# EAGLE schematic LRA_TestSiteJunctionBox (EAGLE 8.7.1)
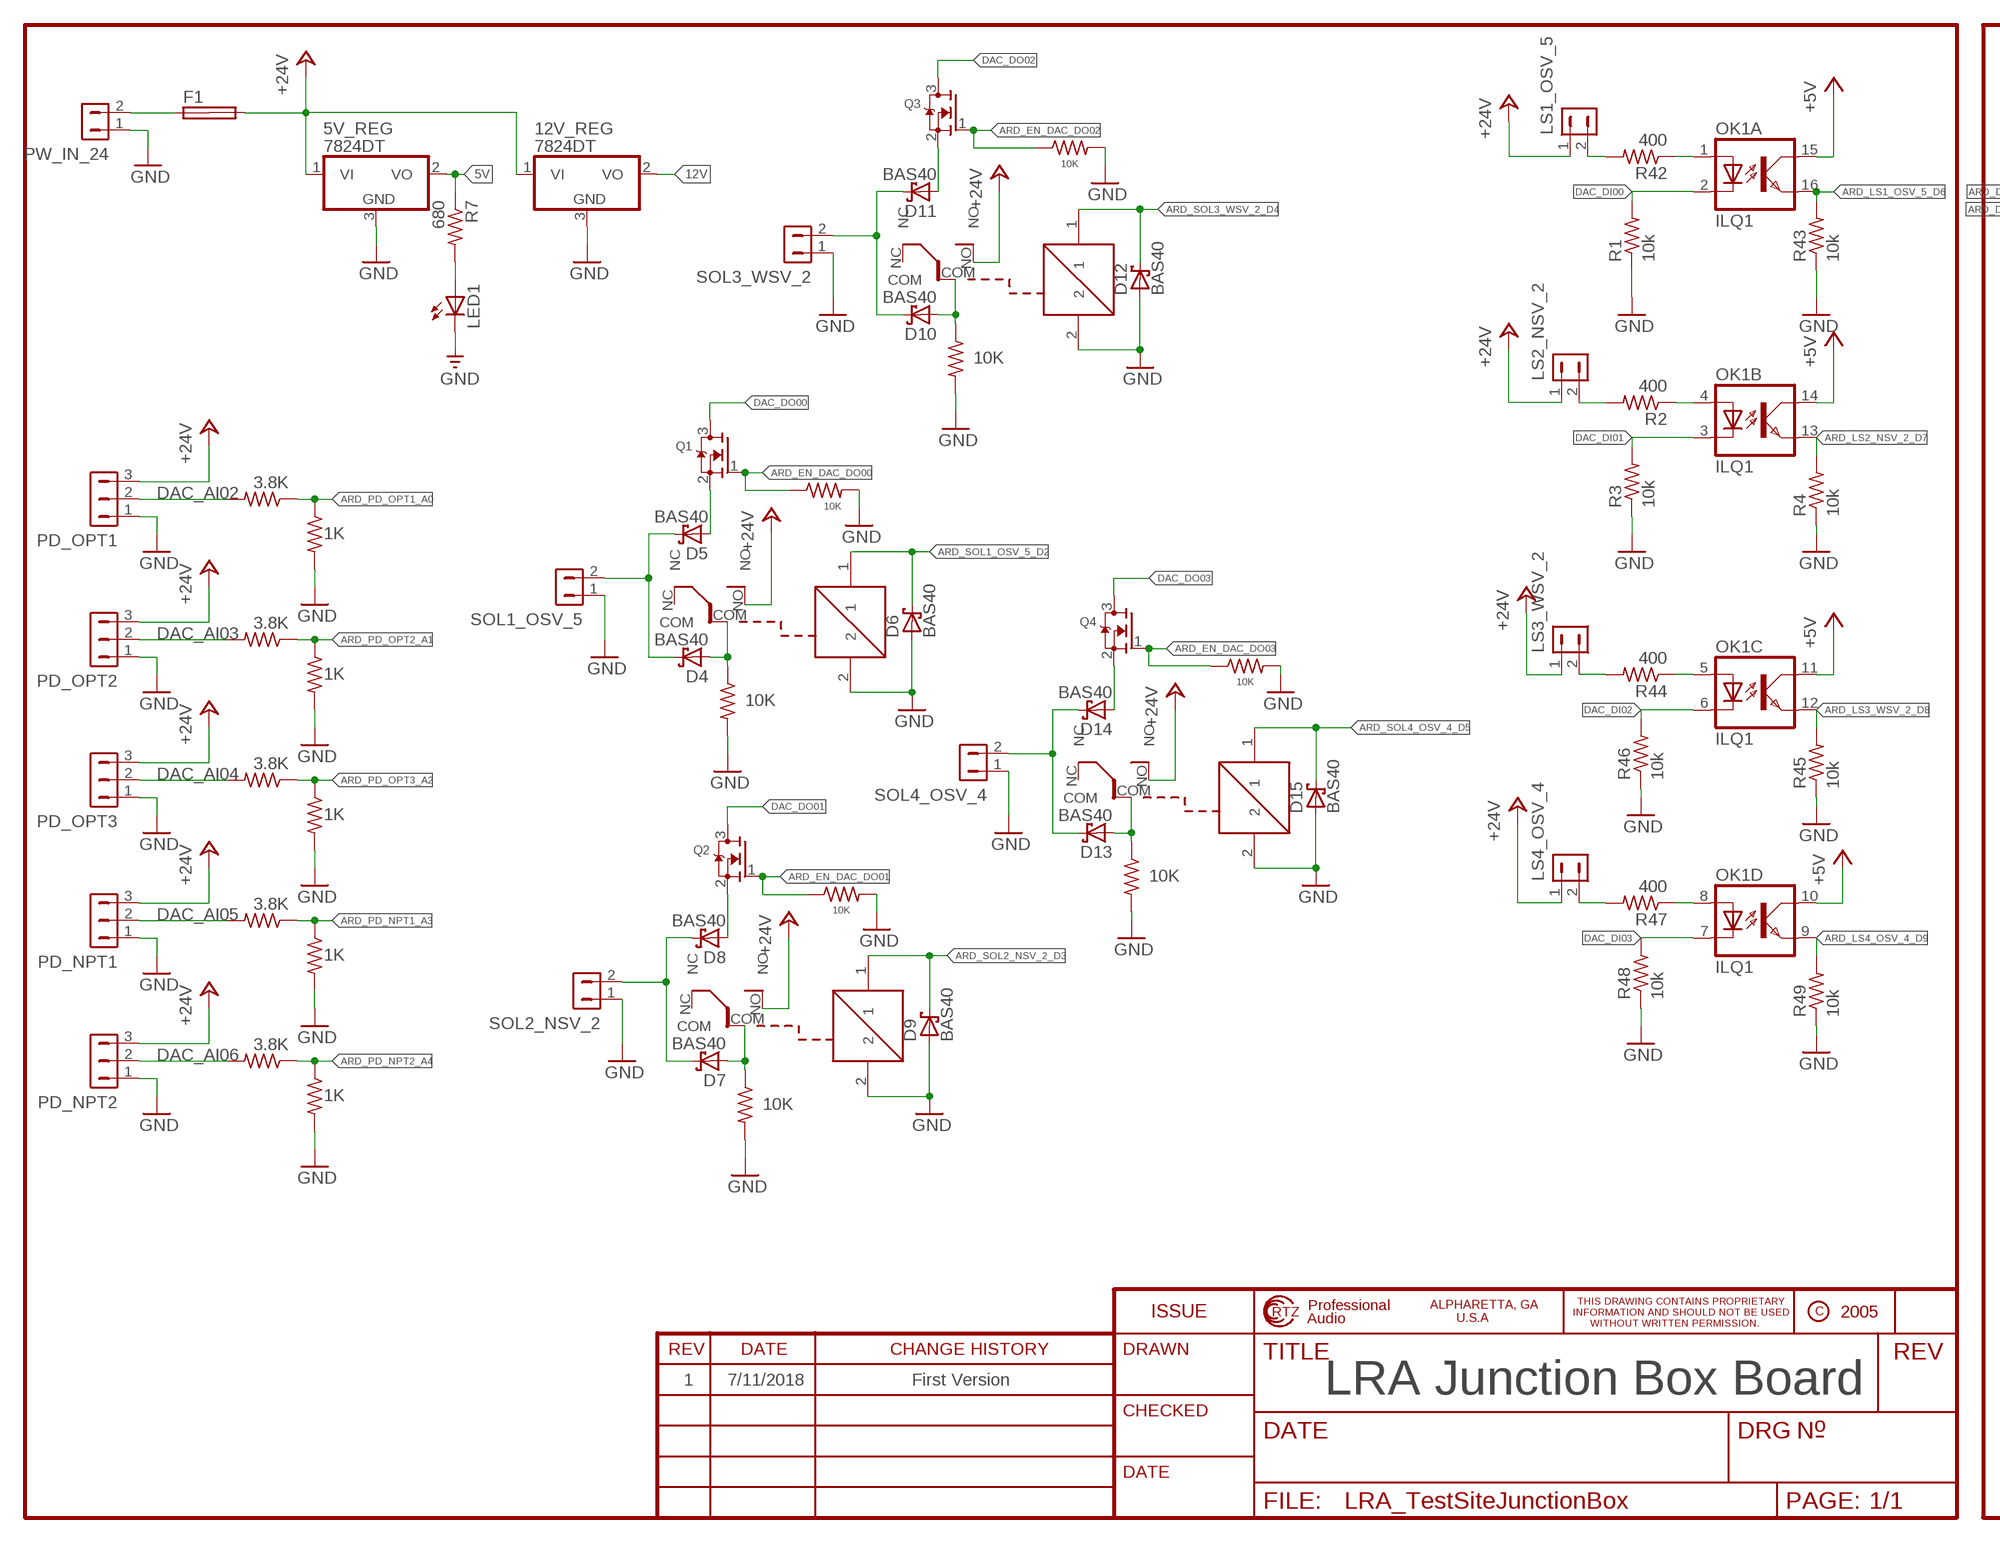
[diagram p0: schematic, sheet 1, part 1 of 2]
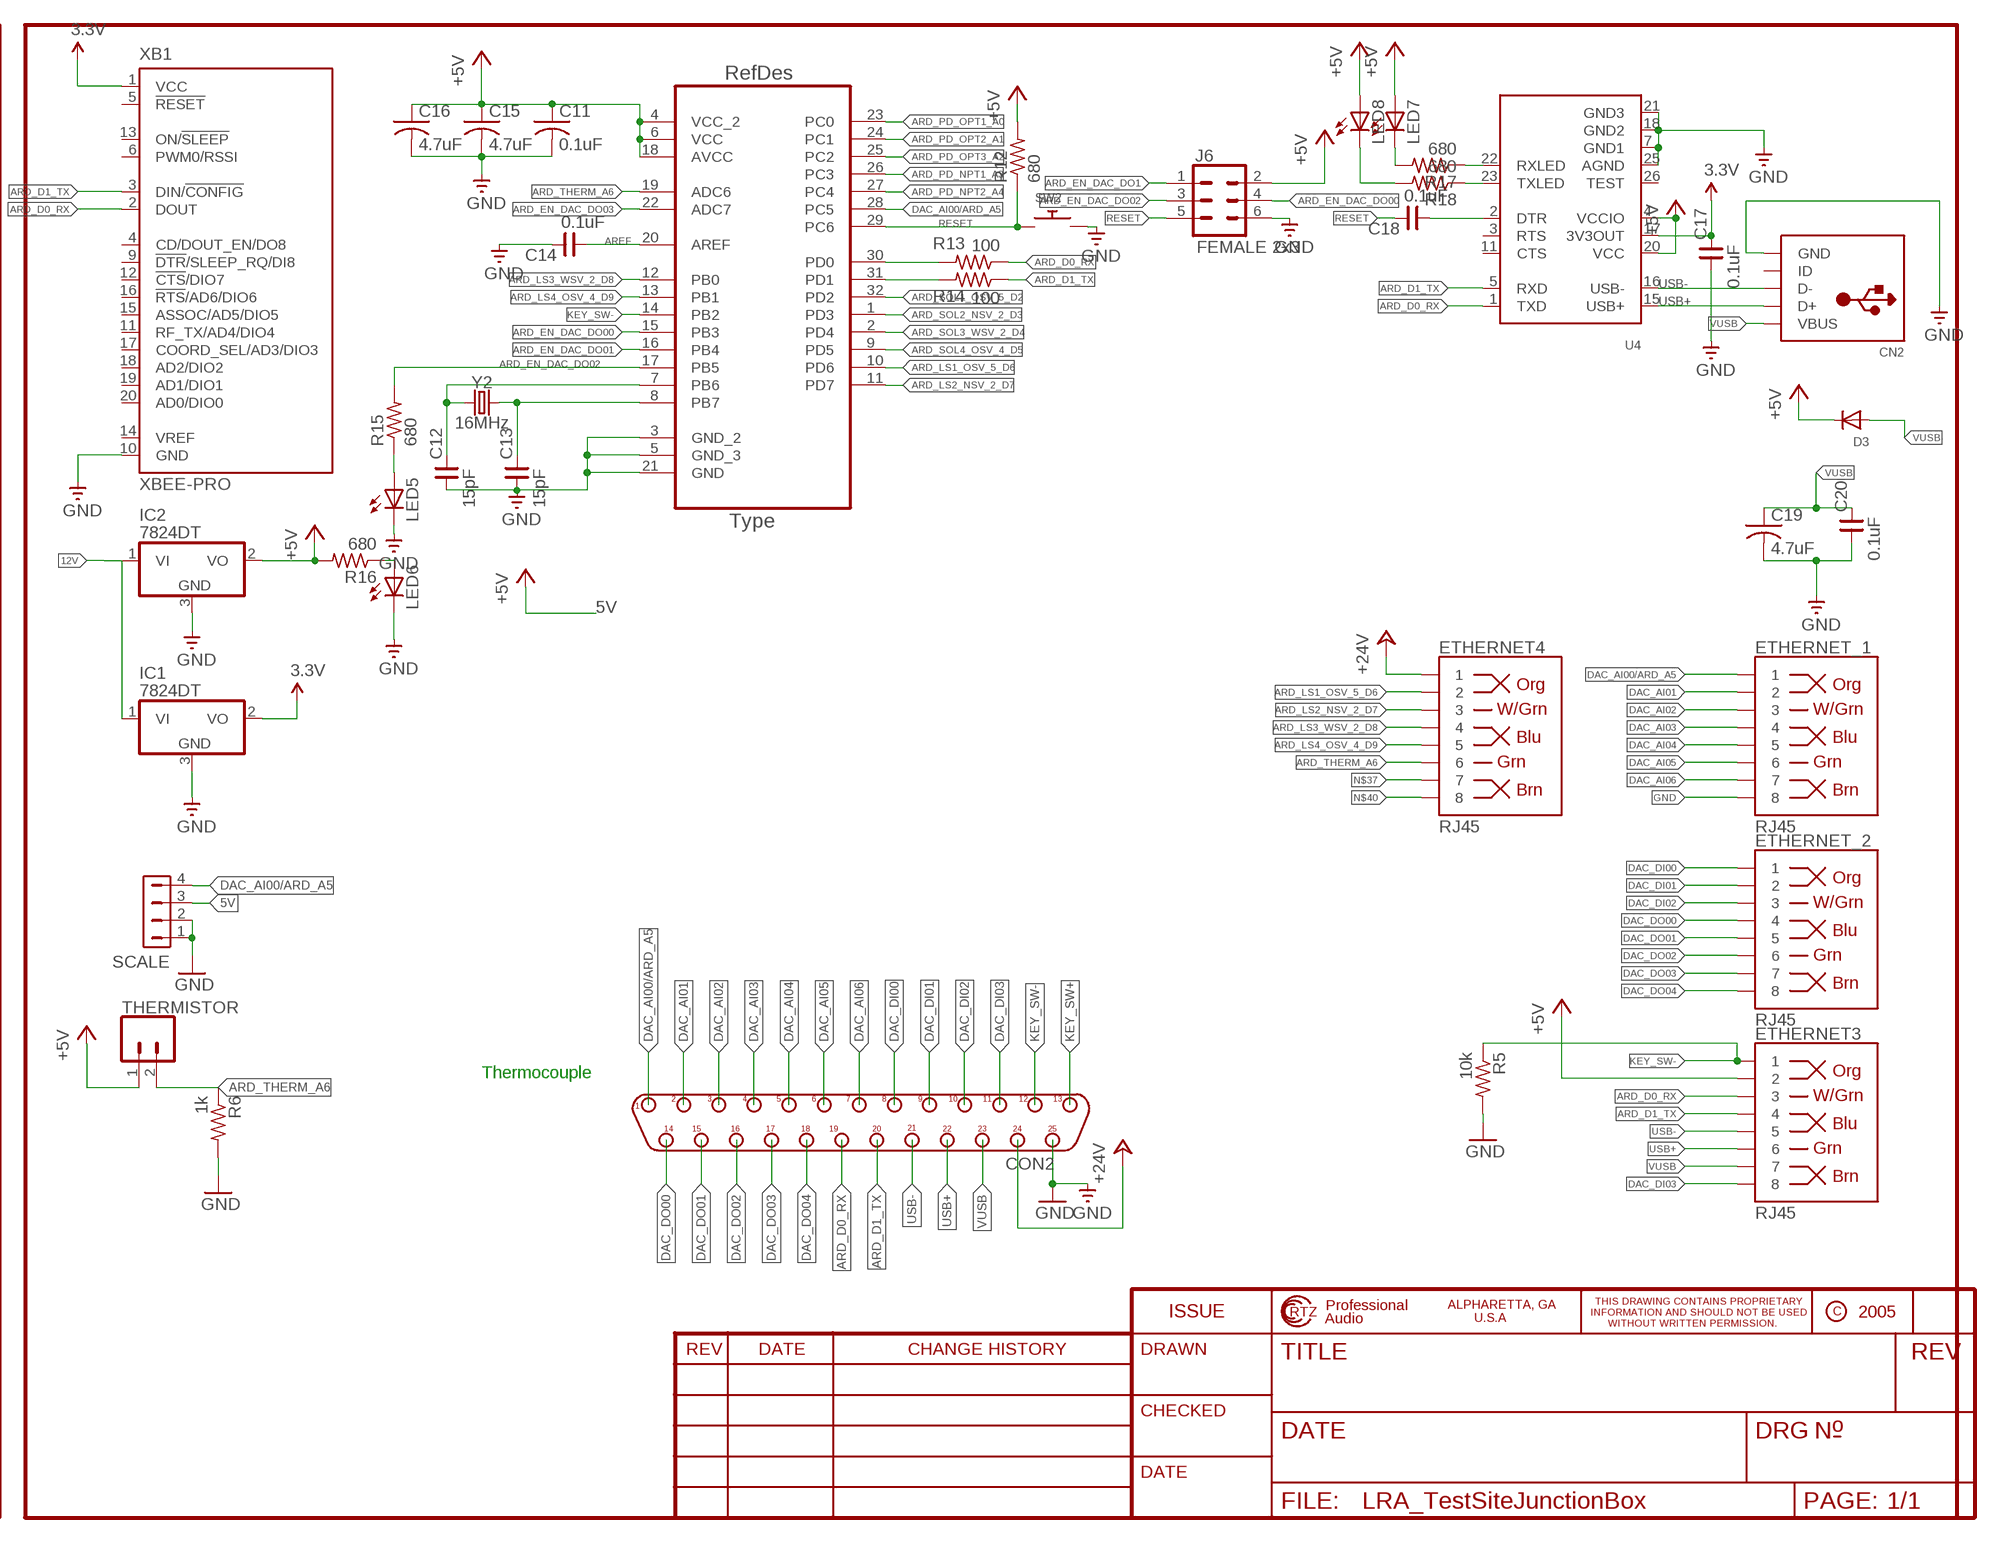
[diagram p1: schematic, sheet 1, part 2 of 2]

## Parts
5V_REG  7824DT  [TO252]
12V_REG  7824DT  [TO252]
C11  0.1uF  C-USC0805  [C0805]
C12  15pF  CNP-0805  [0805]
C13  15pF  CNP-0805  [0805]
C14  0.1uF  CNP-0805  [0805]
C15  4.7uF  C-USC0805  [C0805]
C16  4.7uF  C-USC0805  [C0805]
C17  0.1uF  CNP-0805  [0805]
C18  0.1uF  CNP-0805  [0805]
C19  4.7uF  C-USC0805  [C0805]
C20  0.1uF  CNP-0805  [0805]
CN2  USBMINIB  [USB-MINIB]
CON2  DB25M/90  [D-25M/90]
D3  DIODESOD-123  [SOD-123]
D4  BAS40  [SOT23]
D5  BAS40  [SOT23]
D6  BAS40  [SOT23]
D7  BAS40  [SOT23]
D8  BAS40  [SOT23]
D9  BAS40  [SOT23]
D10  BAS40  [SOT23]
D11  BAS40  [SOT23]
D12  BAS40  [SOT23]
D13  BAS40  [SOT23]
D14  BAS40  [SOT23]
D15  BAS40  [SOT23]
ETHERNET3  RJ45  RJ45-8  [RJ45-8]
ETHERNET4  RJ45  RJ45-8  [RJ45-8]
ETHERNET_1  RJ45  RJ45-8  [RJ45-8]
ETHERNET_2  RJ45  RJ45-8  [RJ45-8]
F1  SHK20L  [SHK20L]
IC1  7824DT  [TO252]
IC2  7824DT  [TO252]
J6  FEMALE 2x3  CONN_03X2FEMALE  [2X3]
LED1  LEDCHIPLED_0805  [CHIPLED_0805]
LED5  LEDCHIPLED_0805  [CHIPLED_0805]
LED6  LEDCHIPLED_0805  [CHIPLED_0805]
LED7  LEDCHIPLED_0805  [CHIPLED_0805]
LED8  LEDCHIPLED_0805  [CHIPLED_0805]
LS1_OSV_5  HDR-1X2-MTA-100  [MTA-100-2V]
LS2_NSV_2  HDR-1X2-MTA-100  [MTA-100-2V]
LS3_WSV_2  HDR-1X2-MTA-100  [MTA-100-2V]
LS4_OSV_4  HDR-1X2-MTA-100  [MTA-100-2V]
OK1  ILQ1  [DIL16]
PD_NPT1  HDR-1X3-MTA-100  [MTA-100-3V]
PD_NPT2  HDR-1X3-MTA-100  [MTA-100-3V]
PD_OPT1  HDR-1X3-MTA-100  [MTA-100-3V]
PD_OPT2  HDR-1X3-MTA-100  [MTA-100-3V]
PD_OPT3  HDR-1X3-MTA-100  [MTA-100-3V]
PW_IN_24  HDR-1X2-MTA-100  [MTA-100-2V]
Q1  MOSFET-NREFLOW  [SOT23]
Q2  MOSFET-NREFLOW  [SOT23]
Q3  MOSFET-NREFLOW  [SOT23]
Q4  MOSFET-NREFLOW  [SOT23]
R1  10k  R-US_M0805  [M0805]
R2  400  R-US_M0805  [M0805]
R3  10k  R-US_M0805  [M0805]
R4  10k  R-US_M0805  [M0805]
R5  10k  R-US_R0805  [R0805]
R6  1k  R-US_R0805  [R0805]
R7  680  R-US_R0805  [R0805]
R12  680  R-US_R0805  [R0805]
R13  100  R-US_R0805  [R0805]
R14  100  R-US_R0805  [R0805]
R15  680  R-US_R0805  [R0805]
R16  680  R-US_R0805  [R0805]
R17  680  R-US_R0805  [R0805]
R18  680  R-US_R0805  [R0805]
R24  3.8K  R-US_M0805  [M0805]
R25  1K  R-US_M0805  [M0805]
R26  3.8K  R-US_M0805  [M0805]
R27  1K  R-US_M0805  [M0805]
R28  3.8K  R-US_M0805  [M0805]
R29  1K  R-US_M0805  [M0805]
R30  3.8K  R-US_M0805  [M0805]
R31  1K  R-US_M0805  [M0805]
R32  3.8K  R-US_M0805  [M0805]
R33  1K  R-US_M0805  [M0805]
R34  10K  R-US_M0805  [M0805]
R35  10K  R-US_M0805  [M0805]
R36  10K  R-US_M0805  [M0805]
R37  10K  R-US_M0805  [M0805]
R38  10K  R-US_M0805  [M0805]
R39  10K  R-US_M0805  [M0805]
R40  10K  R-US_M0805  [M0805]
R41  10K  R-US_M0805  [M0805]
R42  400  R-US_M0805  [M0805]
R43  10k  R-US_M0805  [M0805]
R44  400  R-US_M0805  [M0805]
R45  10k  R-US_M0805  [M0805]
R46  10k  R-US_M0805  [M0805]
R47  400  R-US_M0805  [M0805]
R48  10k  R-US_M0805  [M0805]
R49  10k  R-US_M0805  [M0805]
SCALE  HDR-1X4-MTA-100  [MTA-100-4V]
SOL1_OSV_5  HDR-1X2-MTA-100  [MTA-100-2V]
SOL2_NSV_2  HDR-1X2-MTA-100  [MTA-100-2V]
SOL3_WSV_2  HDR-1X2-MTA-100  [MTA-100-2V]
SOL4_OSV_4  HDR-1X2-MTA-100  [MTA-100-2V]
SW2  SWITCH_PUSHBUTTONEVQ-PE  [TACT_PANA-EVQ]
THERMISTOR  CONN_025MM  [SCREWTERMINAL-5MM-2]
U3  ATMEGA328P-AU  [QFP80P900X900X120-32N]
U4  FT232RLSSOP28  [SSOP28DB]
U$2  RW-SH  [RW-SH]
U$3  RW-SH  [RW-SH]
U$4  RW-SH  [RW-SH]
U$5  RW-SH  [RW-SH]
XB1  XBEE-PRO  [XBEE-PRO]
Y2  16MHz  CRYSTAL-16MHZPTH-HC49US  [HC49US]

## Nets
3.3V: C17.2 IC1.2(VO) U4.17(3V3OUT) XB1.1(VCC)
5V: 5V_REG.2(VO) R7.1 SCALE.3 ; supply symbol labelled +5V
12V: 12V_REG.2(VO) IC1.1(VI) IC2.1(VI)
+5V: C11.1 C15.1 C16.1 D3.C ETHERNET3.2 IC2.2(VO) J6.2 LED7.A LED8.A OK1.10(D:COL) OK1.11(C:COL) OK1.14(B:COL) OK1.15(A:COL) R12.2 R16.2 THERMISTOR.1 U3.4(VCC_2) U3.6(VCC) U3.18(AVCC) U4.4(VCCIO) U4.20(VCC)
+24V: 5V_REG.1(VI) 12V_REG.1(VI) CON2.24 ETHERNET4.1 F1.2A LS1_OSV_5.1 LS2_NSV_2.1 LS3_WSV_2.1 LS4_OSV_4.1 PD_NPT1.3 PD_NPT2.3 PD_OPT1.3 PD_OPT2.3 PD_OPT3.3 U$2.NO U$3.NO U$4.NO U$5.NO
ARD_D0_RX: CON2.19 ETHERNET3.3 R13.1 U4.1(TXD) XB1.2(DOUT)
ARD_D1_TX: CON2.20 ETHERNET3.4 R14.1 U4.5(RXD) XB1.3(DIN/!CONFIG)
ARD_EN_DAC_DO00: J6.4 Q1.1(G) R39.1 U3.15(PB3)
ARD_EN_DAC_DO1: J6.1
ARD_EN_DAC_DO01: Q2.1(G) R38.1 U3.16(PB4)
ARD_EN_DAC_DO02: J6.3 Q3.1(G) R15.2 R40.1 U3.17(PB5)
ARD_EN_DAC_DO03: Q4.1(G) R41.1 U3.22(ADC7)
ARD_LS1_OSV_5_D6: ETHERNET4.2 OK1.16(A:EMIT) R43.2 U3.10(PD6)
ARD_LS2_NSV_2_D7: ETHERNET4.3 OK1.13(B:EMIT) R4.2 U3.11(PD7)
ARD_LS3_WSV_2_D8: ETHERNET4.4 OK1.12(C:EMIT) R45.2 U3.12(PB0)
ARD_LS4_OSV_4_D9: ETHERNET4.5 OK1.9(D:EMIT) R49.2 U3.13(PB1)
ARD_PD_NPT1_A3: R30.1 R31.1 U3.26(PC3)
ARD_PD_NPT2_A4: R32.1 R33.1 U3.27(PC4)
ARD_PD_OPT1_A0: R24.1 R25.1 U3.23(PC0)
ARD_PD_OPT2_A1: R26.1 R27.1 U3.24(PC1)
ARD_PD_OPT3_A2: R28.1 R29.1 U3.25(PC2)
ARD_SOL1_OSV_5_D2: D6.3(C) U3.32(PD2) U$2.1
ARD_SOL2_NSV_2_D3: D9.3(C) U3.1(PD3) U$3.1
ARD_SOL3_WSV_2_D4: D12.3(C) U3.2(PD4) U$4.1
ARD_SOL4_OSV_4_D5: D15.3(C) U3.9(PD5) U$5.1
ARD_THERM_A6: ETHERNET4.6 R6.1 THERMISTOR.2 U3.19(ADC6)
AREF: C14.1 U3.20(AREF)
DAC_AI00/ARD_A5: CON2.1 ETHERNET_1.1 SCALE.4 U3.28(PC5)
DAC_AI01: CON2.2 ETHERNET_1.2
DAC_AI02: CON2.3 ETHERNET_1.3 PD_OPT1.2 R24.2
DAC_AI03: CON2.4 ETHERNET_1.4 PD_OPT2.2 R26.2
DAC_AI04: CON2.5 ETHERNET_1.5 PD_OPT3.2 R28.2
DAC_AI05: CON2.6 ETHERNET_1.6 PD_NPT1.2 R30.2
DAC_AI06: CON2.7 ETHERNET_1.7 PD_NPT2.2 R32.2
DAC_DI00: CON2.8 ETHERNET_2.1 OK1.2(A:C) R1.2
DAC_DI01: CON2.9 ETHERNET_2.2 OK1.3(B:C) R3.2
DAC_DI02: CON2.10 ETHERNET_2.3 OK1.6(C:C) R46.2
DAC_DI03: CON2.11 ETHERNET3.8 OK1.7(D:C) R48.2
DAC_DO00: CON2.14 ETHERNET_2.4 Q1.3(D)
DAC_DO01: CON2.15 ETHERNET_2.5 Q2.3(D)
DAC_DO02: CON2.16 ETHERNET_2.6 Q3.3(D)
DAC_DO03: CON2.17 ETHERNET_2.7 Q4.3(D)
DAC_DO04: CON2.18 ETHERNET_2.8
GND: 5V_REG.3(GND) 12V_REG.3(GND) C11.2 C12.1 C13.1 C14.2 C15.2 C16.2 C17.1 C19.2 C20.1 CN2.GND CON2.25 D6.1(A) D9.1(A) D12.1(A) D15.1(A) ETHERNET_1.8 IC1.3(GND) IC2.3(GND) J6.6 LED1.C LED5.C LED6.C PD_NPT1.1 PD_NPT2.1 PD_OPT1.1 PD_OPT2.1 PD_OPT3.1 PW_IN_24.1 R1.1 R3.1 R4.1 R5.2 R6.2 R25.2 R27.2 R29.2 R31.2 R33.2 R34.2 R35.2 R36.2 R37.2 R38.2 R39.2 R40.2 R41.2 R43.1 R45.1 R46.1 R48.1 R49.1 SCALE.1 SCALE.2 SOL1_OSV_5.1 SOL2_NSV_2.1 SOL3_WSV_2.1 SOL4_OSV_4.1 SW2.P$2 U3.3(GND_2) U3.5(GND_3) U3.21(GND) U4.7(GND1) U4.18(GND2) U4.21(GND3) U4.25(AGND) U$2.2 U$3.2 U$4.2 U$5.2 XB1.10(GND)
KEY_SW+: CON2.13
KEY_SW-: CON2.12 ETHERNET3.1 R5.1 U3.14(PB2)
N$1: F1.1A PW_IN_24.2
N$2: LED1.A R7.2
N$3: OK1.1(A:A) R42.1
N$5: LED6.A R16.1
N$6: LED5.A R15.1
N$7: D4.3(C) D5.3(C) SOL1_OSV_5.2
N$8: D7.3(C) D8.3(C) SOL2_NSV_2.2
N$9: D4.1(A) R34.1 U$2.COM
N$10: D5.1(A) Q1.2(S)
N$11: D7.1(A) R35.1 U$3.COM
N$12: D8.1(A) Q2.2(S)
N$13: D10.3(C) D11.3(C) SOL3_WSV_2.2
N$14: D10.1(A) R36.1 U$4.COM
N$15: D11.1(A) Q3.2(S)
N$16: D13.3(C) D14.3(C) SOL4_OSV_4.2
N$17: D13.1(A) R37.1 U$5.COM
N$18: C13.2 U3.8(PB7) Y2.2
N$19: C12.2 U3.7(PB6) Y2.1
N$20: R13.2 U3.30(PD0)
N$21: R14.2 U3.31(PD1)
N$26: R17.1 U4.22(RXLED)
N$27: R18.1 U4.23(TXLED)
N$28: LED8.C R18.2
N$29: LED7.C R17.2
N$30: C18.1 U4.2(DTR)
N$31: D14.1(A) Q4.2(S)
N$32: LS1_OSV_5.2 R42.2
N$33: OK1.4(B:A) R2.1
N$36: LS2_NSV_2.2 R2.2
N$37: ETHERNET4.7
N$38: OK1.5(C:A) R44.1
N$39: LS3_WSV_2.2 R44.2
N$40: ETHERNET4.8
N$42: OK1.8(D:A) R47.1
N$43: LS4_OSV_4.2 R47.2
RESET: C18.2 J6.5 R12.1 SW2.P$1 U3.29(PC6)
USB+: CN2.D+ CON2.22 ETHERNET3.6 U4.15(USB+)
USB-: CN2.D- CON2.21 ETHERNET3.5 U4.16(USB-)
VUSB: C19.1 C20.2 CN2.VBUS CON2.23 D3.A ETHERNET3.7
Unconnected: CN2.ID F1.1B F1.2B U4.3(RTS) U4.11(CTS) U4.26(TEST) U$2.NC U$3.NC U$4.NC U$5.NC XB1.4(CD/DOUT_EN/DO8) XB1.5(!RESET) XB1.6(PWM0/RSSI) XB1.9(!DTR!/SLEEP_RQ/DI8) XB1.11(RF_TX/AD4/DIO4) XB1.12(!CTS!/DIO7) XB1.13(ON/!SLEEP) XB1.14(VREF) XB1.15(ASSOC/AD5/DIO5) XB1.16(!RTS!/AD6/DIO6) XB1.17(COORD_SEL/AD3/DIO3) XB1.18(AD2/DIO2) XB1.19(AD1/DIO1) XB1.20(AD0/DIO0)

## Notes on the sheet
- Thermocouple
- 1 | 7/11/2018 | First Version
- LRA Junction Box Board

## Library data of the parts
5V_REG 12V_REG IC1 IC2 = adafruit:78*: Positive VOLTAGE REGULATOR Added bigger pads to the TO-92 package
C11 C15 C16 C19 = adafruit:C-US: CAPACITOR, American symbol
C12-C14 C17 C18 C20 = cap-master:CNP-: NON-POLARIZED CAP
CN2 = adafruit:USB: USB Connectors USBMINIB - Surface Mount Female Mini-B USB Connector 4UConnector: 06564 By microbuilder.eu Thru-hole RA Female Mini-B USB Connector 4UConnector: 18732 By ladyada.net
CON2 = connect:DB25M/90
D3 = adafruit:DIODE: Diode SMADIODE - SMA Surface Mount Package 20V 1A Schottky Diode Digikey: 641-1014-6-ND DO-1N4148 - Through Hole Small Current Diode SOD-123 20V 1 A (.5mV Vf) Schottky Diode - Digikey: MBRX120TPMSCT-ND SOD-323 10V 570mA (.38mV Vf, 3ns) Schottky Diode - Digikey: ZLLS410CT-ND SOD-523 30V 30mA Schottky Diode (RB751S-40TE61) - Digikey: RB751S-40TE61CT-ND SOT23-R/W - SOT23 Package (R = Solder Paste/Reflow Ovens, W = Hand-Soldering) BAT54Film 40V 300mA - Digikey: 497-7162-1-ND
D4-D15 = diode:BAS40: Silicon Schottky Diodes General-purpose diode for high-speed switching
ETHERNET3 ETHERNET4 ETHERNET_1 ETHERNET_2 = SparkFun-Connectors:RJ45-8: RJ45 Jack - 8 pin Simple RJ45, 8-pin connection. Commonly used for Cat5, Cat5e, and Cat6 Ethernet cables. Here is the connector we sell at SparkFun: RJ45 8-Pin Connector <https://www.sparkfun.com/products/643> (PRT-00643) Datasheet <https://cdn.sparkfun.com/datasheets/Prototyping/04908.pdf> It is used on this SparkFun product: SparkFun RJ45 Breakout <https://www.sparkfun.com/products/716> (BOB-00716) Note, you may also be interested in the "MAGJACK" version of this. It is basically a RJ45 connector, but also has some status LEDs built into the connector housing. You can check that out in this library at the device named "MAGJACK.dev" and see these products online: RJ45 Ethernet MagJack-Compatible <https://www.sparkfun.com/products/8534> (PRT-08534) SparkFun RJ45 MagJack Breakout <https://www.sparkfun.com/products/13021> (BOB-13021); PROD_ID: CONN-08506; SF_ID: PRT-00643
F1 = fuse:SHK20L: FUSE HOLDER 5 x 20 mm, SH contact, SHH1 Schukat, E1073 Buerklin; OC_FARNELL: unknown; OC_NEWARK: unknown
J6 = SparkFun-Connectors:CONN_03X2: Multi connection point. Often used as Generic Header-pin footprint for 0.1 inch spaced/style header connections You can populate with any combo of single row headers, but if you'd like an exact match, check these: Header - 2x3 (Male, 0.1") <https://www.sparkfun.com/products/12807> (PRT-12807) Header - 2x3 (Female, 0.1") <https://www.sparkfun.com/products/13010> (PRT-13010) 2x3 Pin Shrouded Header <https://www.sparkfun.com/products/10877> (PRT-10877) On any of the 0.1 inch spaced packages, you can populate with these: Break Away Headers - Straight <https://www.sparkfun.com/products/116> (PRT-00116) Break Away Male Headers - Right Angle <https://www.sparkfun.com/products/553> (PRT-00553) Female Headers <https://www.sparkfun.com/products/115> (PRT-00115) Break Away Headers - Machine Pin <https://www.sparkfun.com/products/117> (PRT-00117) Break Away Female Headers - Swiss Machine Pin <https://www.sparkfun.com/products/743> (PRT-00743) Special note: the shrouded connector mates well with our 3x2 ribbon cables: Ribbon Crimp Connector - 6-pin (2x3, Female) <https://www.sparkfun.com/products/10651> (PRT-10651) Ribbon Cable - 6 wire (15ft) <https://www.sparkfun.com/products/10646> (PRT-10646); PROD_ID: CONN-11566
LED1 LED5-LED8 = adafruit:LED: LED OSRAM: - CHIPLED LG R971, LG N971, LY N971, LG Q971, LY Q971, LO R971, LY R971 LH N974, LH R974 LS Q976, LO Q976, LY Q976 LO Q996 - Hyper CHIPLED LW Q18S LB Q993, LB Q99A, LB R99A - SideLED LS A670, LO A670, LY A670, LG A670, LP A670 LB A673, LV A673, LT A673, LW A673 LH A674 LY A675 LS A676, LA A676, LO A676, LY A676, LW A676 LS A679, LY A679, LG A679 - Hyper Micro SIDELED® LS Y876, LA Y876, LO Y876, LY Y876 LT Y87S - SmartLED LW L88C, LW L88S LB L89C, LB L89S, LG L890 LS L89K, LO L89K, LY L89K LS L896, LA L896, LO L896, LY L896 - TOPLED LS T670, LO T670, LY T670, LG T670, LP T670 LSG T670, LSP T670, LSY T670, LOP T670, LYG T670 LG T671, LOG T671, LSG T671 LB T673, LV T673, LT T673, LW T673 LH T674 LS T676, LA T676, LO T676, LY T676, LB T676, LH T676, LSB T676, LW T676 LB T67C, LV T67C, LT T67C, LS T67K, LO T67K, LY T67K, LW E67C LS E67B, LA E67B, LO E67B, LY E67B, LB E67C, LV E67C, LT E67C LW T67C LS T679, LY T679, LG T679 LS T770, LO T770, LY T770, LG T770, LP T770 LB T773, LV T773, LT T773, LW T773 LH T774 LS E675, LA E675, LY E675, LS T675 LS T776, LA T776, LO T776, LY T776, LB T776 LHGB T686 LT T68C, LB T68C - Hyper Mini TOPLED® LB M676 - Mini TOPLED Santana® LG M470 LS M47K, LO M47K, LY M47K Source: http://www.osram.convergy.de/
LS1_OSV_5 LS2_NSV_2 LS3_WSV_2 LS4_OSV_4 PW_IN_24 SOL1_OSV_5 SOL2_NSV_2 SOL3_WSV_2 SOL4_OSV_4 = con-hdrs40:HDR-1X2: HEADER CONNECTOR
OK1 = optocoupler:ILQ1: SIEMENS OPTO COUPLER; MF: VISHAY/TELEFUNKEN; MPN: ILQ1; OC_FARNELL: 1469501; OC_NEWARK: 88K1954
PD_NPT1 PD_NPT2 PD_OPT1-PD_OPT3 = con-hdrs40:HDR-1X3: HEADER CONNECTOR
Q1-Q4 = adafruit:MOSFET-N: N-Channel Mosfet 2N7002E - 60V 260mA SOT23 [Digikey: 2N7002ET1GOSTR-ND] - REEL BSH103 - 30V 850mA SOT23 [Digikey: 568-5013-1-ND]
R1-R7 R12-R18 R24-R49 = adafruit:R-US_: RESISTOR, American symbol
SCALE = con-hdrs40:HDR-1X4: HEADER CONNECTOR
SW2 = adafruit:SWITCH_PUSHBUTTON: Buttons SOFTTOUCHSMD_SJ - Soft touch temporary push button (Super Junk Akihabara) Compatible with SKPMANE010 [Mouser: 688-SKPMAN] C&K_KSS = Digikey: KSS221GLFS
THERMISTOR = SparkFun-Connectors:CONN_02: Multi connection point. Often used as Generic Header-pin footprint for 0.1 inch spaced/style header connections On any of the 0.1 inch spaced packages, you can populate with these: Break Away Headers - Straight <https://www.sparkfun.com/products/116> (PRT-00116) Break Away Male Headers - Right Angle <https://www.sparkfun.com/products/553> (PRT-00553) Female Headers <https://www.sparkfun.com/products/115> (PRT-00115) Break Away Headers - Machine Pin <https://www.sparkfun.com/products/117> (PRT-00117) Break Away Female Headers - Swiss Machine Pin <https://www.sparkfun.com/products/743> (PRT-00743) For SCREWTERMINALS and SPRING TERMINALS visit here: Screw Terimnals on SparkFun.com <https://www.sparkfun.com/search/results?term=Screw+Terminals> (5mm/3.5mm/2.54mm spacing) This device is also useful as a general connection point to wire up your design to another part of your project. Our various solder wires solder well into these plated through hole pads. Hook-Up Wire - Assortment (Stranded, 22 AWG) <https://www.sparkfun.com/products/11375> (PRT-11375) Hook-Up Wire - Assortment (Solid Core, 22 AWG) <https://www.sparkfun.com/products/11367> (PRT-11367) View the entire wire category on our website here <https://www.sparkfun.com/categories/141> Special notes: Molex polarized connector foot print use with: PRT-08233 with associated crimp pins and housings. 2.54_SCREWTERM for use with PRT-10571. 3.5mm Screw Terminal footprints for PRT-08084 5mm Screw Terminal footprints for use with PRT-08432; SF_SKU: PRT-08432
U3 = Atmel-ATMEGA328P-AU:ATMEGA328P-AU; DESCRIPTION: 8-bit Microcontroller with In-System Programmable Flash; MPN: ATMEGA328P-AU; OC_FARNELL: 1715486; OC_NEWARK: 14R4631; PACKAGE: TQFP-32; SUPPLIER: Atmel
U4 = microbuilder:FT232RL: FTDI FT232RL USB TO RS232 Converter Digikey: 768-1007-1-ND
U$2-U$5 = goodsky1:RW-SH
XB1 = maxstream:XBEE: XBee (TM) /XBee-PRO(TM) OEM RF Modules Source: MaxStream, Inc. xbee_productmanual.pdf; MPN: XBP24-AWI-001; OC_FARNELL: 1337916; OC_NEWARK: 42M2667
Y2 = SparkFun-Clocks:CRYSTAL-16MHZ: 16MHz Crystal Digikey Example <http://www.digikey.com/product-search/en?keywords=535-9122-1-ND> Frequency: 16MHz Frequency Stability: ±50ppm Frequency Tolerance: ±20ppm Load Capacitance: 18pF SparkFun Products: Pro Micro -5V/16MHz <https://www.sparkfun.com/products/12640> SparkFun Serial Enabled LCD Kit <https://www.sparkfun.com/products/10097>; PROD_ID: XTAL-08181; SF_ID: COM-00536

## Net classes
0 default: width 0.305 mm
1 +5V: width 0.61 mm
2 +12V: width 0.61 mm
3 5V: width 0.61 mm